# Altium schematic sheet schematic_ad15.SchDoc
size A2
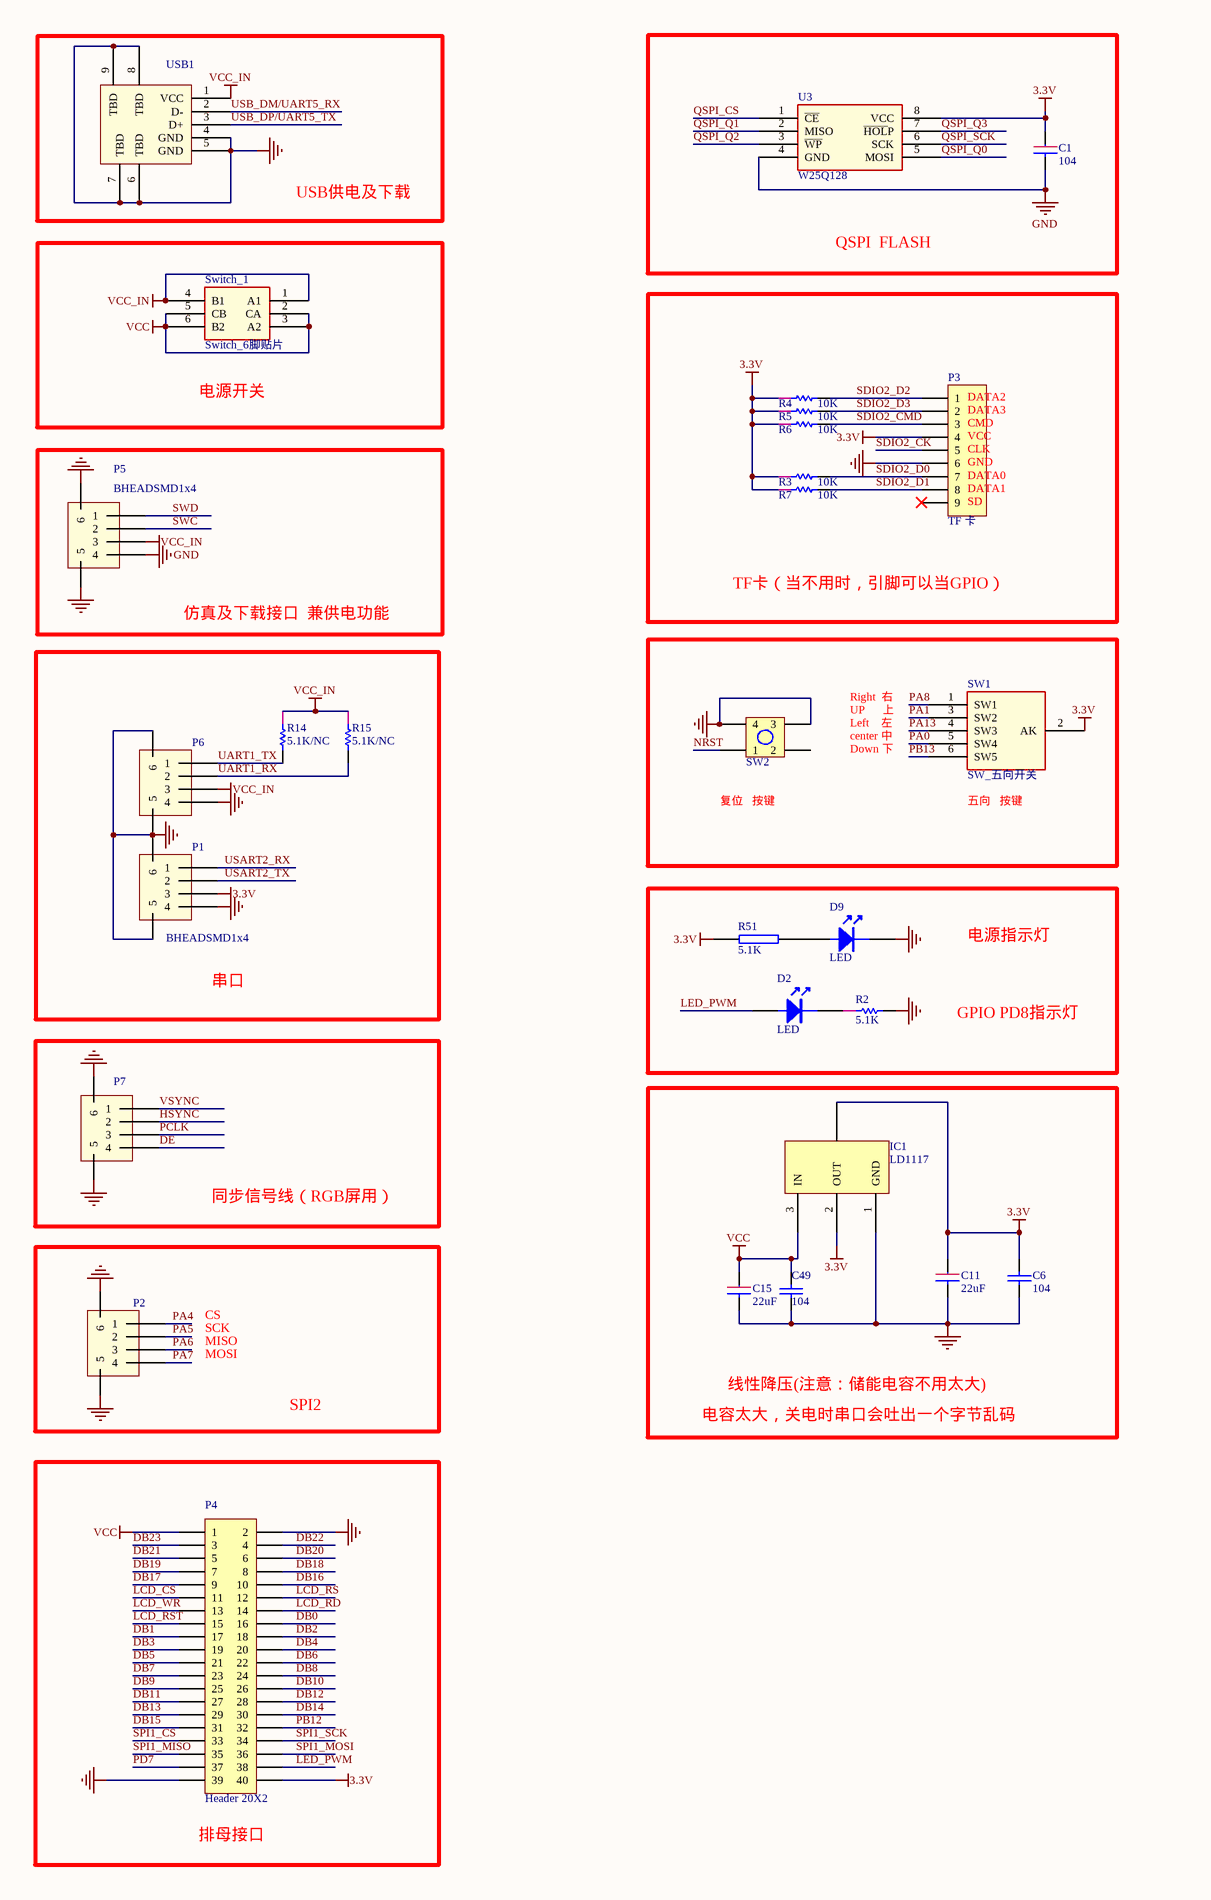
[diagram p0: schematic_ad15.SchDoc, left]
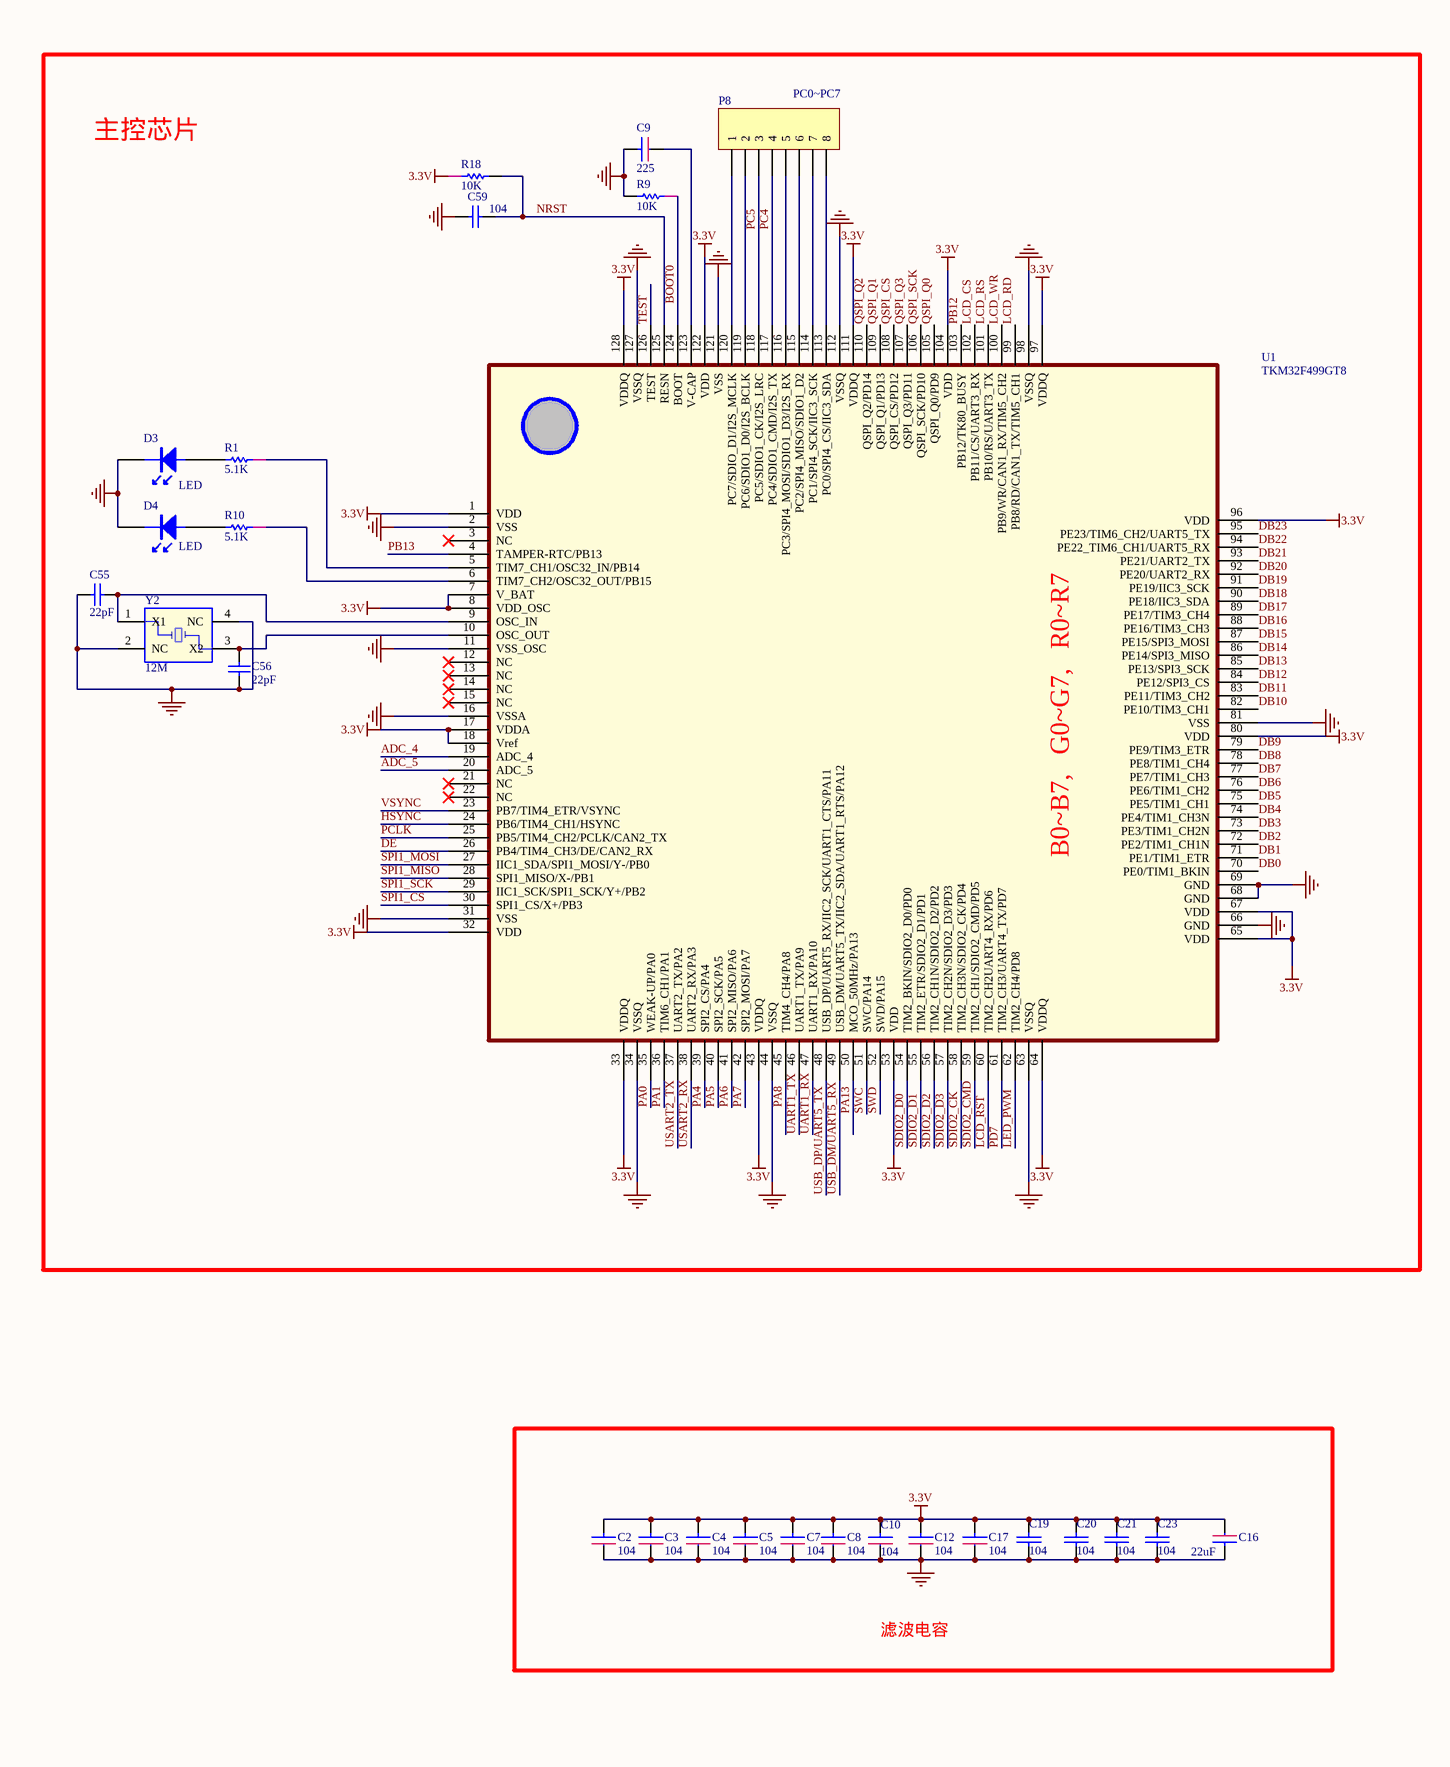
[diagram p1: schematic_ad15.SchDoc, right]

## Parts
C1  104  [C0402-1]
C2  104  [C0402-1]
C3  104  [C0402-1]
C4  104  [C0402-1]
C5  104  [C0402-1]
C6  104  [C0402-1]
C7  104  [C0402-1]
C8  104  [C0402-1]
C9  225  [C0603-2]
C10  104  [C0402-1]
C11  22uF  [Case B 3528]
C12  104  [C0402-1]
C15  22uF  [Case B 3528]
C16  22uF  [C0805-3]
C17  104  [C0402-1]
C19  104  [C0402-1]
C20  104  [C0402-1]
C21  104  [C0402-1]
C23  104  [C0402-1]
C49  104  [C0402-1]
C55  22pF  [C0402-2]
C56  22pF  [C0402-2]
C59  104  [C0402-1]
D2  LED  [D0603]
D3  LED  [D0603]
D4  LED  [D0603]
D9  LED  [D0603]
IC1  LD1117  [SOT223]
P1  BHEADSMD1x4  [BHEADSMD1x4]
P2  BHEADSMD1x4  [BHEADSMD1x4]  (value not drawn)
P3  TF 卡  [Micro_SD]
P4  Header 20X2  [P_Head_2x20]
P5  BHEADSMD1x4  [BHEADSMD1x4]
P6  BHEADSMD1x4  [BHEADSMD1x4]  (value not drawn)
P7  BHEADSMD1x4  [BHEADSMD1x4]  (value not drawn)
P8  PC0~PC7  [HDR1X8]
R1  5.1K  [R0402]
R2  5.1K  [R0402]
R3  10K  [R0402]
R4  10K  [R0402]
R5  10K  [R0402]
R6  10K  [R0402]
R7  10K  [R0402]
R9  10K  [R0402]
R10  5.1K  [R0402]
R14  5.1K/NC  [R0402]
R15  5.1K/NC  [R0402]
R18  10K  [R0402]
R51  5.1K  [R0402]
SW1  SW_五向开关  [五向开关]
SW2  SW  [SW]  (value not drawn)
Switch_1  Switch_6脚贴片  [Switch_6脚贴片]
U1  TKM32F499GT8  [LQFP128]
U3  W25Q128  [SOP8-215-50]
USB1  Micro USB  [MicroUSB_带定位柱]  (value not drawn)
Y2  12M  [X3225]

## Blocks framed on the sheet
USB供电及下载: USB1
QSPI  FLASH: C1 U3
主控芯片: C9 C55 C56 C59 D3 D4 P8 R1 R9 R10 R18 U1 Y2
电源开关: Switch_1
TF卡（当不用时，引脚可以当GPIO）: P3 R3-R7
仿真及下载接口  兼供电功能: P5
串口: P1 P6 R14 R15
同步信号线（RGB屏用）: P7
SPI2: P2
滤波电容: C2-C5 C7 C8 C10 C12 C16 C17 C19-C21 C23
排母接口: P4

## Nets
3.3V: C1.1 C2.2 C3.2 C4.2 C5.2 C6.1 C7.2 C8.2 C10.2 C11.1 C12.2 C16.1 C17.2 C19.2 C20.2 C21.2 C23.2 IC1.2(OUT) P1.3 P3.4 P4.40 R3.1 R4.1 R5.1 R6.1 R7.1 R18.1 R51.1 SW1.2(AK) U1.1(VDD) U1.7(V_BAT) U1.8(VDD_OSC) U1.17(VDDA) U1.18(Vref) U1.32(VDD) U1.33(VDDQ) U1.43(VDDQ) U1.53(VDD) U1.64(VDDQ) U1.65(VDD) U1.67(VDD) U1.80(VDD) U1.96(VDD) U1.97(VDDQ) U1.104(VDD) U1.111(VDDQ) U1.122(VDD) U1.128(VDDQ) U3.8(VCC)
GND: C1.2 C2.1 C3.1 C4.1 C5.1 C6.2 C7.1 C8.1 C9.2 C10.1 C11.2 C12.1 C15.2 C16.2 C17.1 C19.1 C20.1 C21.1 C23.1 C49.1 C55.1 C56.1 C59.1 D3.2 D4.2 D9.2 IC1.1(GND) P1.4 P1.5 P1.6 P2.5 P2.6 P3.6 P4.2 P4.39 P5.4 P5.5 P5.6 P6.4 P6.5 P6.6 P7.5 P7.6 R2.2 R9.2 SW2.3 SW2.4 U1.2(VSS) U1.11(VSS_OSC) U1.16(VSSA) U1.31(VSS) U1.34(VSSQ) U1.44(VSSQ) U1.63(VSSQ) U1.66(GND) U1.68(GND) U1.69(GND) U1.81(VSS) U1.98(VSSQ) U1.112(VSSQ) U1.121(VSS) U1.127(VSSQ) U3.4(GND) USB1.4(GND) USB1.5(GND) USB1.6(TBD) USB1.7(TBD) USB1.8(TBD) USB1.9(TBD) Y2.2(NC) Y2.4(NC)
VCC: C15.1 C49.2 IC1.3(IN) P4.1 Switch_1.2(CA) Switch_1.3(A2) Switch_1.5(CB) Switch_1.6(B2)
VCC_IN: P5.3 P6.3 R14.1 R15.1 Switch_1.1(A1) Switch_1.4(B1) USB1.1(VCC)
ADC_4: U1.19(ADC_4)
ADC_5: U1.20(ADC_5)
BOOT0: R9.1 U1.124(BOOT)
DB0: P4.16 U1.70(PE0/TIM1_BKIN)
DB1: P4.17 U1.71(PE1/TIM1_ETR)
DB2: P4.18 U1.72(PE2/TIM1_CH1N)
DB3: P4.19 U1.73(PE3/TIM1_CH2N)
DB4: P4.20 U1.74(PE4/TIM1_CH3N)
DB5: P4.21 U1.75(PE5/TIM1_CH1)
DB6: P4.22 U1.76(PE6/TIM1_CH2)
DB7: P4.23 U1.77(PE7/TIM1_CH3)
DB8: P4.24 U1.78(PE8/TIM1_CH4)
DB9: P4.25 U1.79(PE9/TIM3_ETR)
DB10: P4.26 U1.82(PE10/TIM3_CH1)
DB11: P4.27 U1.83(PE11/TIM3_CH2)
DB12: P4.28 U1.84(PE12/SPI3_CS)
DB13: P4.29 U1.85(PE13/SPI3_SCK)
DB14: P4.30 U1.86(PE14/SPI3_MISO)
DB15: P4.31 U1.87(PE15/SPI3_MOSI)
DB16: P4.10 U1.88(PE16/TIM3_CH3)
DB17: P4.9 U1.89(PE17/TIM3_CH4)
DB18: P4.8 U1.90(PE18/IIC3_SDA)
DB19: P4.7 U1.91(PE19/IIC3_SCK)
DB20: P4.6 U1.92(PE20/UART2_RX)
DB21: P4.5 U1.93(PE21/UART2_TX)
DB22: P4.4 U1.94(PE22_TIM6_CH1/UART5_RX)
DB23: P4.3 U1.95(PE23/TIM6_CH2/UART5_TX)
DE: P7.4 U1.26(PB4/TIM4_CH3/DE/CAN2_RX)
HSYNC: P7.2 U1.24(PB6/TIM4_CH1/HSYNC)
LCD_CS: P4.11 U1.102(PB11/CS/UART3_RX)
LCD_RD: P4.14 U1.99(PB8/RD/CAN1_TX/TIM5_CH1)
LCD_RS: P4.12 U1.101(PB10/RS/UART3_TX)
LCD_RST: P4.15 U1.60(TIM2_CH2UART4_RX/PD6)
LCD_WR: P4.13 U1.100(PB9/WR/CAN1_RX/TIM5_CH2)
LED_PWM: D2.1 P4.38 U1.62(TIM2_CH4/PD8)
NRST: C59.2 R18.2 SW2.1 U1.125(RESN)
PA0: SW1.5(SW4) U1.35(WEAK-UP/PA0)
PA1: SW1.3(SW2) U1.36(TIM6_CH1/PA1)
PA4: P2.1 U1.39(SPI2_CS/PA4)
PA5: P2.2 U1.40(SPI2_SCK/PA5)
PA6: P2.3 U1.41(SPI2_MISO/PA6)
PA7: P2.4 U1.42(SPI2_MOSI/PA7)
PA8: SW1.1(SW1) U1.45(TIM4_CH4/PA8)
PA13: SW1.4(SW3) U1.50(MCO_50MHz/PA13)
PB12: P4.32 U1.103(PB12/TK80_BUSY)
PB13: SW1.6(SW5) U1.4(TAMPER-RTC/PB13)
PC4: P8.4 U1.117(PC4/SDIO1_CMD/I2S_TX)
PC5: P8.3 U1.118(PC5/SDIO1_CK/I2S_LRC)
PCLK: P7.3 U1.25(PB5/TIM4_CH2/PCLK/CAN2_TX)
PD7: P4.37 U1.61(TIM2_CH3/UART4_TX/PD7)
QSPI_CS: U1.108(QSPI_CS/PD12) U3.1(~{CE})
QSPI_Q0: U1.105(QSPI_Q0/PD9) U3.5(MOSI)
QSPI_Q1: U1.109(QSPI_Q1/PD13) U3.2(MISO)
QSPI_Q2: U1.110(QSPI_Q2/PD14) U3.3(~{WP})
QSPI_Q3: U1.107(QSPI_Q3/PD11) U3.7(~{HOL}P)
QSPI_SCK: U1.106(QSPI_SCK/PD10) U3.6(SCK)
SDIO2_CK: P3.5 U1.58(TIM2_CH3N/SDIO2_CK/PD4)
SDIO2_CMD: P3.3 R6.2 U1.59(TIM2_CH1/SDIO2_CMD/PD5)
SDIO2_D0: P3.7 R3.2 U1.54(TIM2_BKIN/SDIO2_D0/PD0)
SDIO2_D1: P3.8 R7.2 U1.55(TIM2_ETR/SDIO2_D1/PD1)
SDIO2_D2: P3.1 R4.2 U1.56(TIM2_CH1N/SDIO2_D2/PD2)
SDIO2_D3: P3.2 R5.2 U1.57(TIM2_CH2N/SDIO2_D3/PD3)
SPI1_CS: P4.33 U1.30(SPI1_CS/X+/PB3)
SPI1_MISO: P4.35 U1.28(SPI1_MISO/X-/PB1)
SPI1_MOSI: P4.36 U1.27(IIC1_SDA/SPI1_MOSI/Y-/PB0)
SPI1_SCK: P4.34 U1.29(IIC1_SCK/SPI1_SCK/Y+/PB2)
SWC: P5.2 U1.51(SWC/PA14)
SWD: P5.1 U1.52(SWD/PA15)
TEST: U1.126(TEST)
UART1_RX: P6.2 R15.2 U1.47(UART1_RX/PA10)
UART1_TX: P6.1 R14.2 U1.46(UART1_TX/PA9)
USART2_RX: P1.1 U1.38(UART2_RX/PA3)
USART2_TX: P1.2 U1.37(UART2_TX/PA2)
USB_DM/UART5_RX: U1.49(USB_DM/UART5_TX/IIC2_SDA/UART1_RTS/PA12) USB1.2(D-)
USB_DP/UART5_TX: U1.48(USB_DP/UART5_RX/IIC2_SCK/UART1_CTS/PA11) USB1.3(D+)
VSYNC: P7.1 U1.23(PB7/TIM4_ETR/VSYNC)
NetC9_1: C9.1 U1.123(V-CAP)
NetC55_2: C55.2 U1.9(OSC_IN) Y2.1(X1)
NetC56_2: C56.2 U1.10(OSC_OUT) Y2.3(X2)
NetD2_2: D2.2 R2.1
NetD3_1: D3.1 R1.2
NetD4_1: D4.1 R10.2
NetD9_1: D9.1 R51.2
NetP8_1: P8.1 U1.120(PC7/SDIO_D1/I2S_MCLK)
NetP8_2: P8.2 U1.119(PC6/SDIO1_D0/I2S_BCLK)
NetP8_5: P8.5 U1.116(PC3/SPI4_MOSI/SDIO1_D3/I2S_RX)
NetP8_6: P8.6 U1.115(PC2/SPI4_MISO/SDIO1_D2)
NetP8_7: P8.7 U1.114(PC1/SPI4_SCK/IIC3_SCK)
NetP8_8: P8.8 U1.113(PC0/SPI4_CS/IIC3_SDA)
NetR1_1: R1.1 U1.5(TIM7_CH1/OSC32_IN/PB14)
NetR10_1: R10.1 U1.6(TIM7_CH2/OSC32_OUT/PB15)

Not connected (* = marked no-connect by the designer): P3 9*; SW2 2; U1 3(NC)* 12(NC)* 13(NC)* 14(NC)* 15(NC)* 21(NC)* 22(NC)*

## Notes on the sheet
- (near P3) DATA2
- (near P3) DATA3
- (near P3) VCC
- (near P3) CMD
- (near P3) DATA0
- (near P3) DATA1
- (near P3) SD
- (near P3) GND
- (near P3) CLK
- Right  右
- center 中
- Left    左
- UP      上
- Down 下
- (near SW2) 复位   按键
- (near SW1) 五向   按键
- 电源指示灯
- GPIO PD8指示灯
- CS
- SCK
- MISO
- MOSI
- 电容太大，关电时串口会吐出一个字节乱码
- 线性降压(注意：储能电容不用太大)
- (in symbol TKM32F499GT8) B0~B7,   G0~G7,   R0~R7

## Library data of the parts
C1-C5 C7-C12 C15-C17 = cap
C6 C19-C21 C23 C49 C59 = CAP: Capacitor
  C59: Published: 8-Jun-2000; Revision: July-2002: Re-released for DXP Platform.; Publisher: Altium Limited
C55 C56 = Cap: Capacitor; Published: 8-Jun-2000; LatestRevisionDate: 17-Jul-2002; LatestRevisionNote: Re-released for DXP Platform.; PackageReference: RAD-0.3; Publisher: Altium Limited; PackageDescription: Radial Cap, Thru-Hole; 2 Leads; 0.3 in Pin Spacing; Value: 22pF
P3 = Header 9: Header, 9-Pin; LatestRevisionDate: 17-Jul-2002; LatestRevisionNote: Re-released for DXP Platform.; Publisher: Altium Limited
P4 = Header 20X2: Header, 20-Pin, Dual row; LatestRevisionDate: 17-Jul-2002; LatestRevisionNote: Re-released for DXP Platform.; Publisher: Altium Limited
P8 = Header 8: Header, 8-Pin; LatestRevisionDate: 17-Jul-2002; LatestRevisionNote: Re-released for DXP Platform.; Publisher: Altium Limited
R1-R7 R9 R10 R14 R15 R18 = Resistor
R51 = RES2
U3 = W25Q16
USB1 = Mini USB
Y2 = 晶振_无源_4PIN_SMD